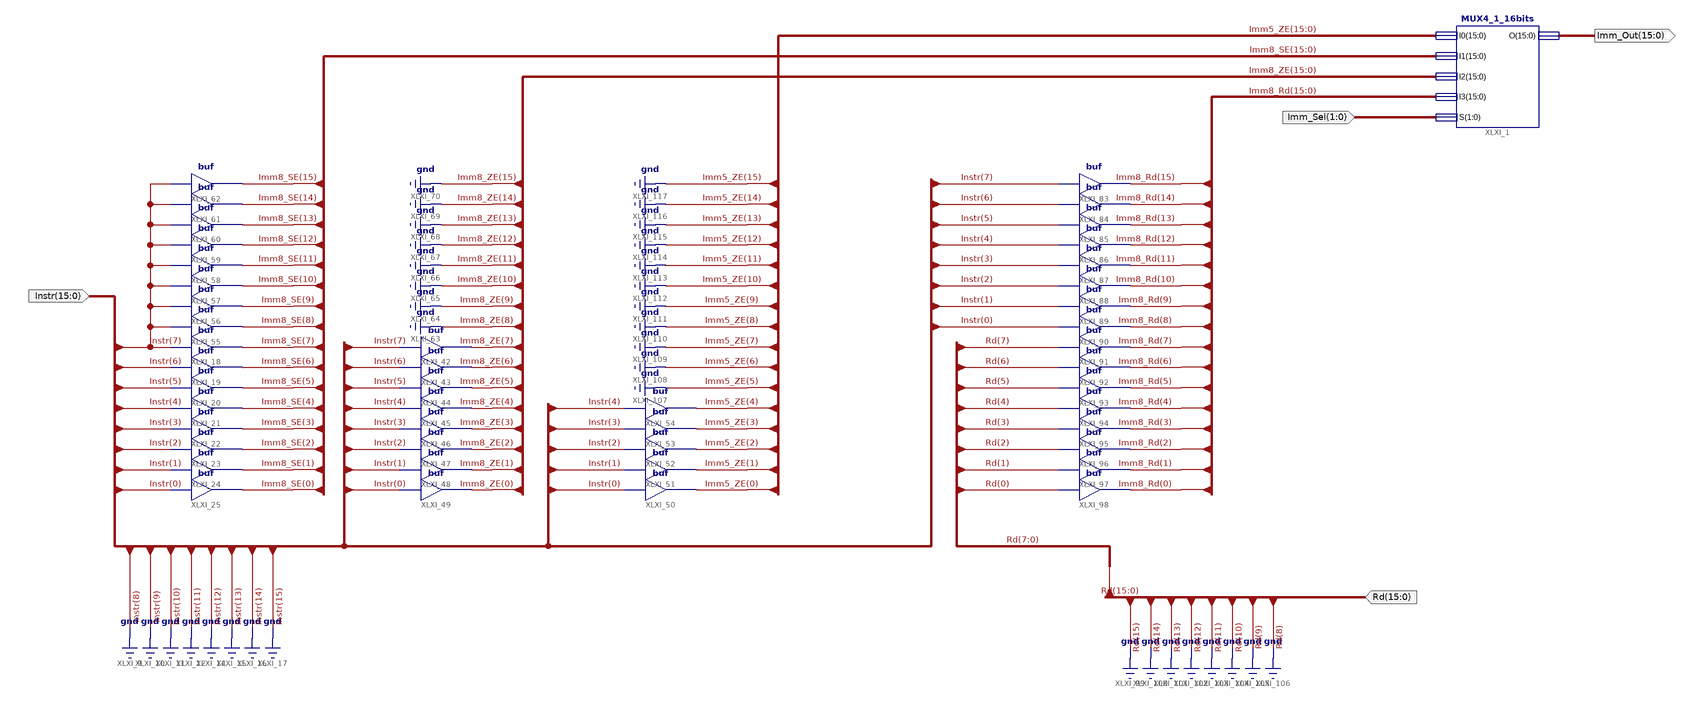
[diagram p0: schematic sheet 1]
// Xilinx ISE schematic Imm_Gen.sch (virtex6) as structural Verilog: 46 symbols, 4 ports
module Imm_Gen (
  input  [15:0] Instr,
  input  [1:0] Imm_Sel,
  input  [15:0] Rd,
  output [15:0] Imm_Out
);

  wire [4:0] Imm5_ZE;
  wire [7:0] Imm8_ZE;
  wire [15:0] Imm8_Rd, Imm8_SE;

  buf XLXI_18 (Imm8_SE[7], Instr[7]);
  buf XLXI_19 (Imm8_SE[6], Instr[6]);
  buf XLXI_20 (Imm8_SE[5], Instr[5]);
  buf XLXI_21 (Imm8_SE[4], Instr[4]);
  buf XLXI_22 (Imm8_SE[3], Instr[3]);
  buf XLXI_23 (Imm8_SE[2], Instr[2]);
  buf XLXI_24 (Imm8_SE[1], Instr[1]);
  buf XLXI_25 (Imm8_SE[0], Instr[0]);
  buf XLXI_42 (Imm8_ZE[7], Instr[7]);
  buf XLXI_43 (Imm8_ZE[6], Instr[6]);
  buf XLXI_44 (Imm8_ZE[5], Instr[5]);
  buf XLXI_45 (Imm8_ZE[4], Instr[4]);
  buf XLXI_46 (Imm8_ZE[3], Instr[3]);
  buf XLXI_47 (Imm8_ZE[2], Instr[2]);
  buf XLXI_48 (Imm8_ZE[1], Instr[1]);
  buf XLXI_49 (Imm8_ZE[0], Instr[0]);
  buf XLXI_50 (Imm5_ZE[0], Instr[0]);
  buf XLXI_51 (Imm5_ZE[1], Instr[1]);
  buf XLXI_52 (Imm5_ZE[2], Instr[2]);
  buf XLXI_53 (Imm5_ZE[3], Instr[3]);
  buf XLXI_54 (Imm5_ZE[4], Instr[4]);
  buf XLXI_55 (Imm8_SE[8], Instr[7]);
  buf XLXI_56 (Imm8_SE[9], Instr[7]);
  buf XLXI_57 (Imm8_SE[10], Instr[7]);
  buf XLXI_58 (Imm8_SE[11], Instr[7]);
  buf XLXI_59 (Imm8_SE[12], Instr[7]);
  buf XLXI_60 (Imm8_SE[13], Instr[7]);
  buf XLXI_61 (Imm8_SE[14], Instr[7]);
  buf XLXI_62 (Imm8_SE[15], Instr[7]);
  MUX4_1_16bits XLXI_1 (
    .I0({{11{1'b0}}, Imm5_ZE}), .I1(Imm8_SE), .I2({{8{1'b0}}, Imm8_ZE}), .I3(Imm8_Rd), .O(Imm_Out),
    .S(Imm_Sel));
  buf XLXI_83 (Imm8_Rd[15], Instr[7]);
  buf XLXI_84 (Imm8_Rd[14], Instr[6]);
  buf XLXI_85 (Imm8_Rd[13], Instr[5]);
  buf XLXI_86 (Imm8_Rd[12], Instr[4]);
  buf XLXI_87 (Imm8_Rd[11], Instr[3]);
  buf XLXI_88 (Imm8_Rd[10], Instr[2]);
  buf XLXI_89 (Imm8_Rd[9], Instr[1]);
  buf XLXI_90 (Imm8_Rd[8], Instr[0]);
  buf XLXI_91 (Imm8_Rd[7], Rd[7]);
  buf XLXI_92 (Imm8_Rd[6], Rd[6]);
  buf XLXI_93 (Imm8_Rd[5], Rd[5]);
  buf XLXI_94 (Imm8_Rd[4], Rd[4]);
  buf XLXI_95 (Imm8_Rd[3], Rd[3]);
  buf XLXI_96 (Imm8_Rd[2], Rd[2]);
  buf XLXI_97 (Imm8_Rd[1], Rd[1]);
  buf XLXI_98 (Imm8_Rd[0], Rd[0]);
  // also tied to GND on the sheet: {Instr[8], Instr[9], Instr[10], Instr[11], Instr[12], Instr[13], Instr[14], Instr[15], Rd[8], Rd[9], Rd[10], Rd[11], Rd[12], Rd[13], Rd[14], Rd[15]}
endmodule
